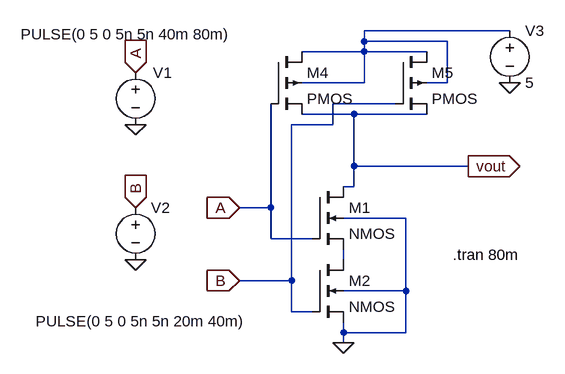
[diagram p0: schematic Nand gate.asc]
Nand gate.asc, the LTspice schematic file:
Version 4.1
SHEET 1 880 680
WIRE 48 -2848 -176 -2848
WIRE -176 -2832 -176 -2848
WIRE -48 -2832 -176 -2832
WIRE -176 -2816 -176 -2832
WIRE -176 -2816 -272 -2816
WIRE -80 -2816 -176 -2816
WIRE -176 -2768 -176 -2816
WIRE -176 -2768 -272 -2768
WIRE -48 -2768 -48 -2832
WIRE -48 -2768 -80 -2768
WIRE -128 -2736 -224 -2736
WIRE -192 -2720 -272 -2720
WIRE -80 -2720 -192 -2720
WIRE -224 -2704 -224 -2736
WIRE -224 -2704 -288 -2704
WIRE -192 -2640 -192 -2720
WIRE -16 -2640 -192 -2640
WIRE -192 -2608 -192 -2640
WIRE -192 -2608 -208 -2608
WIRE -320 -2576 -320 -2736
WIRE -320 -2576 -368 -2576
WIRE -112 -2560 -208 -2560
WIRE -320 -2528 -320 -2576
WIRE -256 -2528 -320 -2528
WIRE -208 -2496 -208 -2512
WIRE -288 -2464 -288 -2704
WIRE -288 -2464 -368 -2464
WIRE -112 -2448 -112 -2560
WIRE -112 -2448 -208 -2448
WIRE -288 -2416 -288 -2464
WIRE -256 -2416 -288 -2416
WIRE -208 -2384 -208 -2400
WIRE -112 -2384 -112 -2448
WIRE -112 -2384 -208 -2384
WIRE -208 -2368 -208 -2384
FLAG -208 -2368 0
FLAG -16 -2640 vout
IOPIN -16 -2640 Out
FLAG -528 -2576 B
IOPIN -528 -2576 In
FLAG -368 -2464 B
IOPIN -368 -2464 In
FLAG -528 -2784 A
IOPIN -528 -2784 In
FLAG -368 -2576 A
IOPIN -368 -2576 In
FLAG -528 -2496 0
FLAG -528 -2704 0
FLAG 48 -2768 0
SYMBOL pmos4 -320 -2816 R0
SYMATTR InstName M4
SYMBOL pmos4 -128 -2816 R0
SYMATTR InstName M5
SYMBOL nmos4 -256 -2608 R0
SYMATTR InstName M1
SYMBOL nmos4 -256 -2496 R0
SYMATTR InstName M2
SYMBOL voltage -528 -2800 R0
WINDOW 0 56 16 Right 2
WINDOW 3 -177 -43 Left 2
WINDOW 123 0 0 Left 0
WINDOW 39 0 0 Left 0
SYMATTR InstName V1
SYMATTR Value PULSE(0 5 0 5n 5n 40m 80m)
SYMBOL voltage -528 -2592 R0
WINDOW 3 -154 191 Left 2
WINDOW 123 0 0 Left 0
WINDOW 39 0 0 Left 0
SYMATTR Value PULSE(0 5 0 5n 5n 20m 40m)
SYMATTR InstName V2
SYMBOL voltage 48 -2864 R0
WINDOW 123 0 0 Left 0
WINDOW 39 0 0 Left 0
SYMATTR InstName V3
SYMATTR Value 5
TEXT -40 -2504 Left 2 !.tran 80m

The netlist it stands for:
* Nand gate.asc
M4 N001 A vout N001 PMOS
M5 N001 B vout N001 PMOS
M1 vout A N002 0 NMOS
M2 N002 B 0 0 NMOS
V1 A 0 PULSE(0 5 0 5n 5n 40m 80m)
V2 B 0 PULSE(0 5 0 5n 5n 20m 40m)
V3 N001 0 5
.model NMOS NMOS
.model PMOS PMOS
.lib standard.mos
.tran 80m
.backanno
.end